# EAGLE design Controller (EAGLE 4.16)

## Sheet 1 of 2
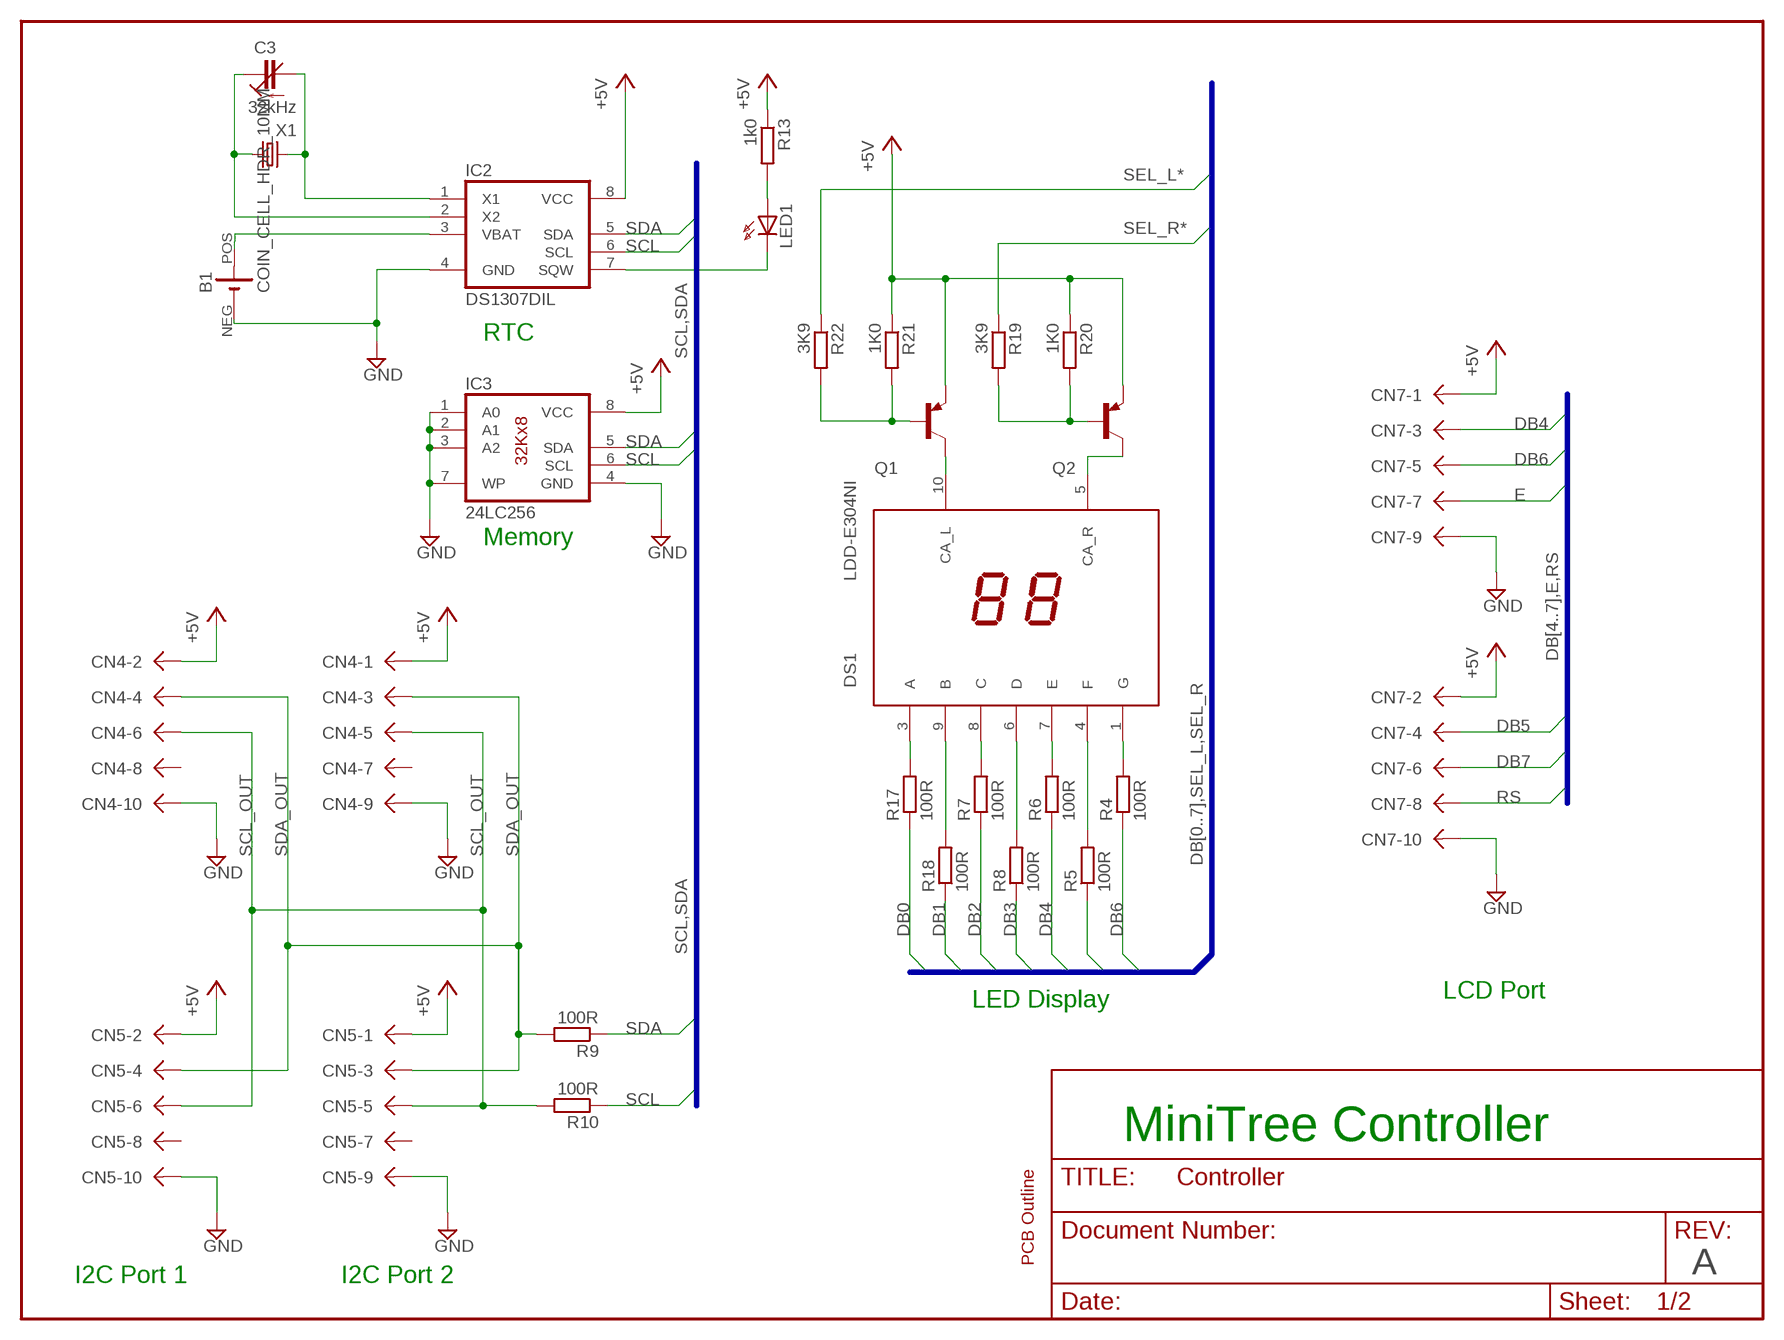
[diagram p0: schematic, sheet 1]

### Parts
B1  COIN_CELL_HDR_10MM  [COIN_10MM_SINGLE_PCB]
C3  GKG20066  [SURFTRIM]
CN4  HDR2X5  [HDR2X5]
CN5  HDR2X5  [HDR2X5]
CN7  HDR2X5  [HDR2X5]
DS1  LDD-E304NI  [DIL10_4]
IC2  DS1307DIL  [DIL08]
IC3  24LC256  [DIL8]
LED1  LEDSMT1206  [1206]
Q1  MMBT4403LT1-PNP-SOT23-BEC  [SOT23-BEC]
Q2  MMBT4403LT1-PNP-SOT23-BEC  [SOT23-BEC]
R4  100R  R-EU_M1206  [M1206]
R5  100R  R-EU_M1206  [M1206]
R6  100R  R-EU_M1206  [M1206]
R7  100R  R-EU_M1206  [M1206]
R8  100R  R-EU_M1206  [M1206]
R9  100R  R-EU_M1206  [M1206]
R10  100R  R-EU_M1206  [M1206]
R13  1k0  R-EU_M1206  [M1206]
R17  100R  R-EU_M1206  [M1206]
R18  100R  R-EU_M1206  [M1206]
R19  3K9  R-EU_M1206  [M1206]
R20  1K0  R-EU_M1206  [M1206]
R21  1K0  R-EU_M1206  [M1206]
R22  3K9  R-EU_M1206  [M1206]
U$1  3.5X6_VREG  [3.5X6_VREG]
X1  32kHz  CRYTALTC26H  [TC26H]

### Nets
+5V: CN4.1 CN4.2 CN5.1 CN5.2 CN7.1 CN7.2 IC2.8(VCC) IC3.8(VCC) Q1.E Q2.E R13.1 R20.1 R21.1 ; also sheet 2
DB0: R17.1 ; also sheet 2
DB1: R18.1 ; also sheet 2
DB2: R7.1 ; also sheet 2
DB3: R8.1 ; also sheet 2
DB4: CN7.6 R6.1 ; also sheet 2
DB5: CN7.5 R5.1 ; also sheet 2
DB6: CN7.4 R4.1 ; also sheet 2
DB7: CN7.3 ; also sheet 2
E: CN7.7 ; also sheet 2
GND: B1.NEG(-) CN4.9 CN4.10 CN5.9 CN5.10 CN7.9 CN7.10 IC2.4(GND) IC3.1(A0) IC3.2(A1) IC3.3(A2) IC3.4(GND) IC3.7(WP) ; also sheet 2
N$1: B1.POS(+) IC2.3(VBAT)
N$7: C3.2(E) IC2.2(X2) X1.1
N$8: C3.1(A) IC2.1(X1) X1.2
N$9: IC2.7(SQW) LED1.C
N$10: LED1.A R13.2
N$13: DS1.10(CA_L) Q1.C
N$14: DS1.5(CA_R) Q2.C
N$15: Q1.B R21.2 R22.2
N$16: Q2.B R19.2 R20.2
N$17: DS1.3(A) R17.2
N$18: DS1.9(B) R18.2
N$19: DS1.8(C) R7.2
N$20: DS1.6(D) R8.2
N$21: DS1.7(E) R6.2
N$22: DS1.4(F) R5.2
N$23: DS1.1(G) R4.2
RS: CN7.8 ; also sheet 2
SCL: IC2.6(SCL) IC3.6(SCL) R10.1 ; also sheet 2
SCL_OUT: CN4.5 CN4.6 CN5.5 CN5.6 R10.2
SDA: IC2.5(SDA) IC3.5(SDA) R9.1 ; also sheet 2
SDA_OUT: CN4.3 CN4.4 CN5.3 CN5.4 R9.2
SEL_L*: R22.1 ; also sheet 2
SEL_R*: R19.1 ; also sheet 2
Unconnected: CN4.7 CN4.8 CN5.7 CN5.8

### Buses
DB[0..7],SEL_L,SEL_R
SCL,SDA
DB[4..7],E,RS

### Notes on the sheet
- RTC
- Memory
- LCD Port
- LED Display
- MiniTree Controller
- A
- I2C Port 1 | I2C Port 2

## Sheet 2 of 2
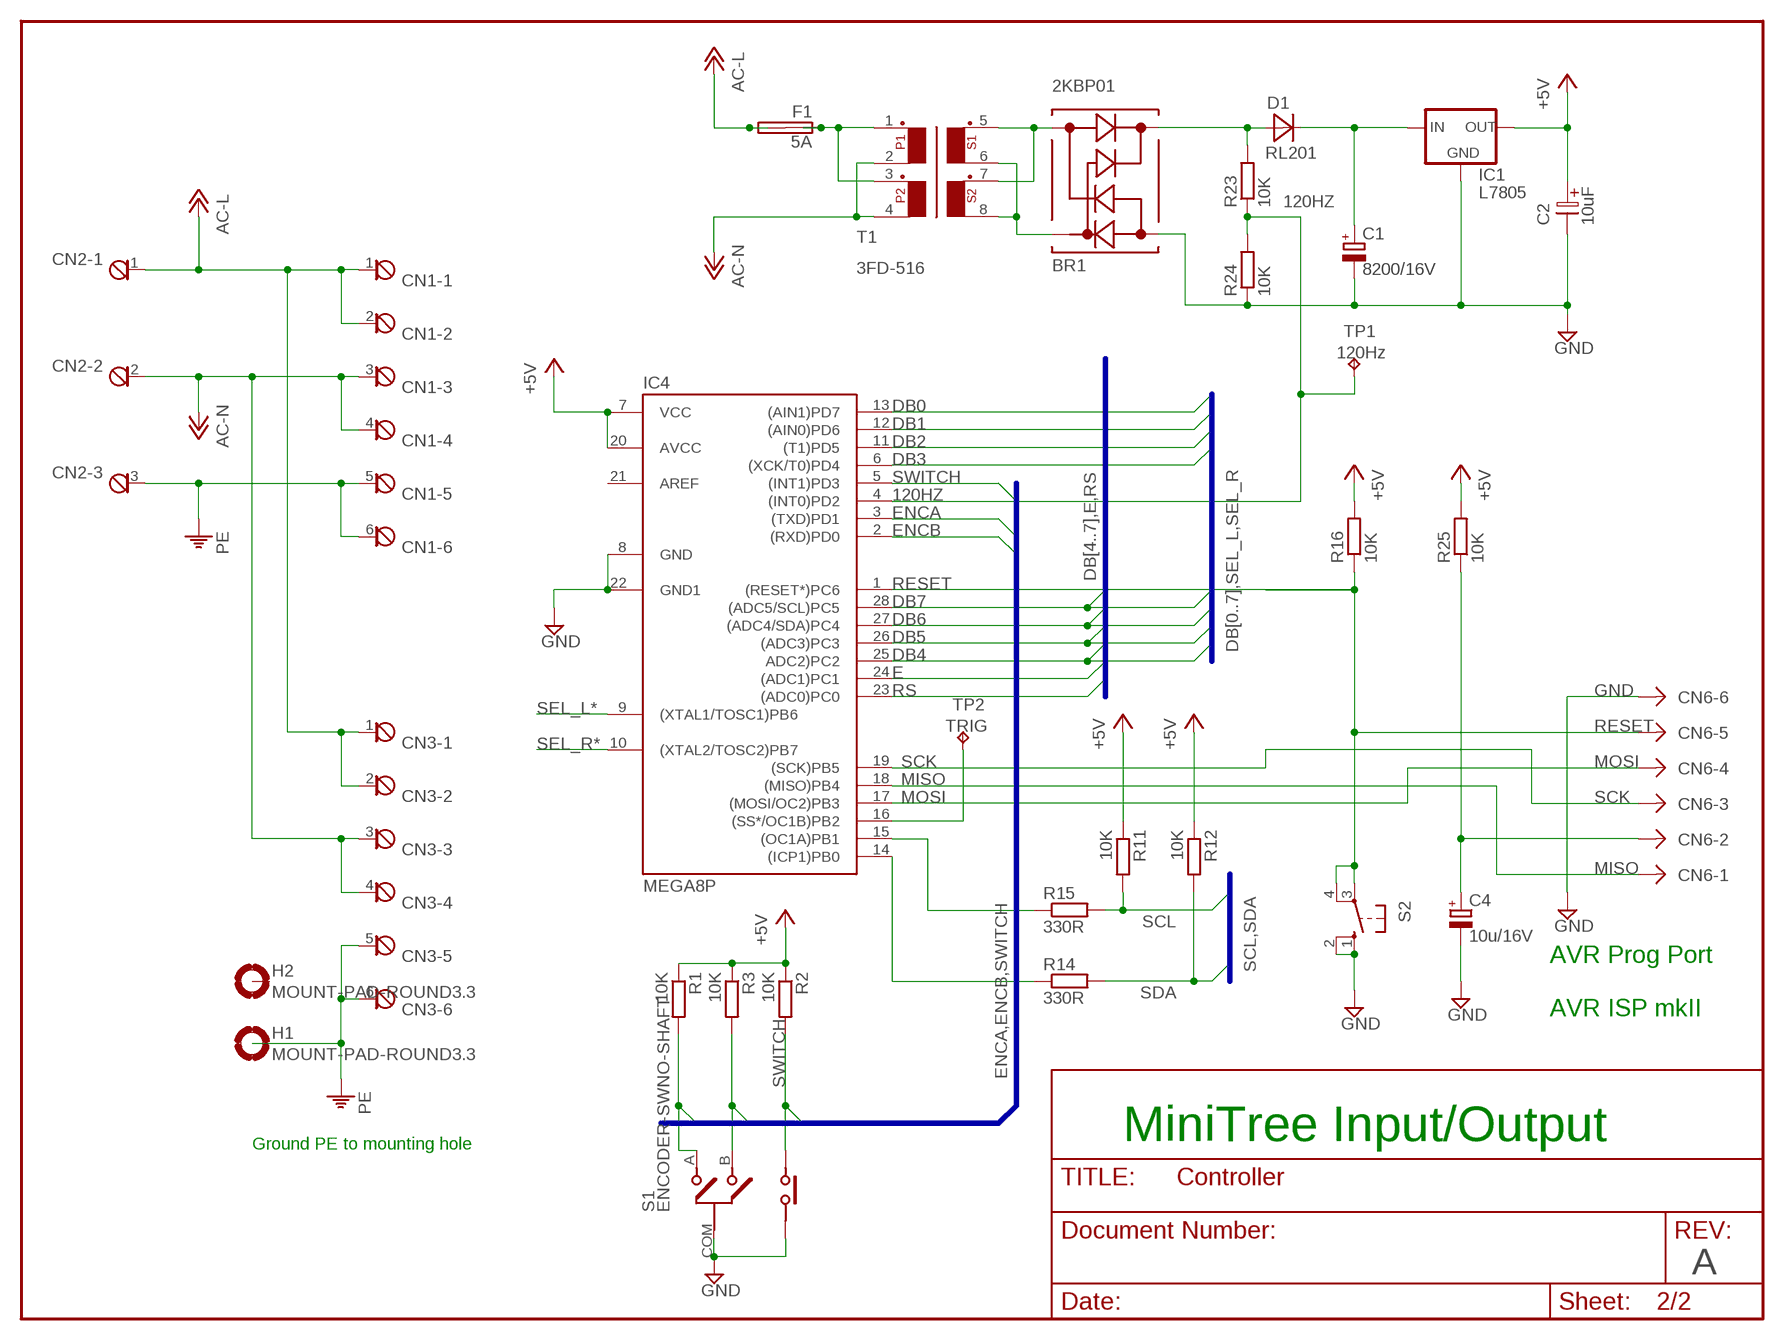
[diagram p1: schematic, sheet 2]

### Parts
BR1  2KBP01  [KBPM]
C1  8200/16V  CPOL-EUE7.5-18  [E7,5-18]
C2  10uF  ELC-2,5L  [ES-2,5L]
C4  10u/16V  CPOL-EUA  [PANASONIC_A]
CN1  OSTTB06  [OSTTB06]
CN2  OSTTB03  [OSTTB03]
CN3  OSTTB06  [OSTTB06]
CN6  HDR2X3  [HDR2X3]
D1  RL201  [DO-15]
F1  5A  SHK20L  [SHK20L]
H1  MOUNT-PAD-ROUND3.3  [3,3-PAD]
H2  MOUNT-PAD-ROUND3.3  [3,3-PAD]
IC1  L7805  L78  [TO220TRI2]
IC4  MEGA8P  [DIL28-3]
R1  10K  R-EU_M1206  [M1206]
R2  10K  R-EU_M1206  [M1206]
R3  10K  R-EU_M1206  [M1206]
R11  10K  R-EU_M1206  [M1206]
R12  10K  R-EU_M1206  [M1206]
R14  330R  R-EU_M1206  [M1206]
R15  330R  R-EU_M1206  [M1206]
R16  10K  R-EU_M1206  [M1206]
R23  10K  R-EU_M1206  [M1206]
R24  10K  R-EU_M1206  [M1206]
R25  10K  R-EU_M1206  [M1206]
S1  ENCODER-SWNO-SHAFT  [X288_NO_SHAFT]
S2  10-XX  [B3F-10XX]
T1  3FD-516  [3FD-5XX]
TP1  120Hz  KEYSTONE_MINIATURE  [KEYSTONE_MINIATURE]
TP2  TRIG  KEYSTONE_MINIATURE  [KEYSTONE_MINIATURE]

### Nets
120HZ: IC4.4((INT0)PD2) R23.1 R24.2 TP1.P$1(TP)
+5V: C2.1 IC1.OUT IC4.7(VCC) IC4.20(AVCC) R1.1 R2.1 R3.1 R11.1 R12.1 R16.2 R25.2 ; also sheet 1
AC-L: CN1.1 CN1.2 CN2.1 CN3.1 CN3.2 F1.2A F1.2B
AC-N: CN1.3 CN1.4 CN2.2 CN3.3 CN3.4 T1.2 T1.4
DB0: IC4.13((AIN1)PD7) ; also sheet 1
DB1: IC4.12((AIN0)PD6) ; also sheet 1
DB2: IC4.11((T1)PD5) ; also sheet 1
DB3: IC4.6((XCK/T0)PD4) ; also sheet 1
DB4: IC4.25(ADC2)PC2) ; also sheet 1
DB5: IC4.26((ADC3)PC3) ; also sheet 1
DB6: IC4.27((ADC4/SDA)PC4) ; also sheet 1
DB7: IC4.28((ADC5/SCL)PC5) ; also sheet 1
E: IC4.24((ADC1)PC1) ; also sheet 1
ENCA: IC4.3((TXD)PD1) R1.2 S1.A
ENCB: IC4.2((RXD)PD0) R3.2 S1.B
GND: BR1.-VE C1.- C2.2 C4.- CN6.6 IC1.GND IC4.8(GND) IC4.22(GND1) R24.1 S1.COM S1.S2 S2.1(S) S2.2(S1) ; also sheet 1
MISO: CN6.1 IC4.18((MISO)PB4)
MOSI: CN6.4 IC4.17((MOSI/OC2)PB3)
N$2: F1.1A F1.1B T1.1 T1.3
N$3: BR1.+VE D1.A R23.2
N$4: BR1.AC1 T1.5 T1.7
N$5: C1.+ D1.C IC1.IN
N$6: BR1.AC2 T1.6 T1.8
N$11: IC4.15((OC1A)PB1) R15.1
N$12: IC4.14((ICP1)PB0) R14.1
N$24: IC4.16((SS*/OC1B)PB2) TP2.P$1(TP)
N$54: C4.+ CN6.2 R25.1
PE: CN1.5 CN1.6 CN2.3 CN3.5 CN3.6 H1.B3,3(MOUNT)
RESET: CN6.5 IC4.1((RESET*)PC6) R16.1 S2.3(P) S2.4(P1)
RS: IC4.23((ADC0)PC0) ; also sheet 1
SCK: CN6.3 IC4.19((SCK)PB5)
SCL: R11.2 R15.2 ; also sheet 1
SDA: R12.2 R14.2 ; also sheet 1
SEL_L*: IC4.9((XTAL1/TOSC1)PB6) ; also sheet 1
SEL_R*: IC4.10((XTAL2/TOSC2)PB7) ; also sheet 1
SWITCH: IC4.5((INT1)PD3) R2.2 S1.S1
Unconnected: H2.B3,3(MOUNT)

### Buses
DB[4..7],E,RS
SCL,SDA
DB[0..7],SEL_L,SEL_R
ENCA,ENCB,SWITCH

### Notes on the sheet
- AVR Prog Port
- AVR ISP mkII
- MiniTree Input/Output
- Ground PE to mounting hole
- A

## Power pins joined to a net without a drawn wire
AREF: IC4.21(AREF)

## Library data of the parts
B1 = battery:COIN_CELL_HDR_10MM
BR1 = rectifier:2KBP*
C1 C4 = rcl:CPOL-EU: POLARIZED CAPACITOR, European symbol
C2 = discrete:ELC-2,5L
C3 = Cap_variable_SMT:GKG20066: Sparague Goodman Surftrim 4.5/20pF
CN1 CN3 = con-OSTTBXX:OSTTB06
CN2 = con-OSTTBXX:OSTTB03
CN4 CN5 CN7 = con-amp-modu-header:HDR2X5
CN6 = con-amp-modu-header:HDR2X3
D1 = diode:RL20*
DS1 = display-LED:LDD-E304NI
F1 = fuse:SHK20L: FUSE HOLDER 5 x 20 mm, SH contact, SHH1 Schukat, E1073 Buerklin
H1 H2 = holes:MOUNT-PAD-ROUND: MOUNTING PAD, round
IC1 = v-reg:L78*
IC2 = maxim:DS1307
IC3 = microchip:24LC256
IC4 = atmel:MEGA8P: Atmel AVR Mega8 Peter J. Stonard 20-Oct-04
LED1 = led:LED: LED
Q1 Q2 = transistor:*-PNP-: PNP Transistror
R1-R25 = rcl:R-EU_: RESISTOR, European symbol
S1 = pot:ENCODER-SW*
S2 = switch-omron:10-XX: OMRON SWITCH
T1 = trafo:3FD-5*
TP1 TP2 = testpad:KEYSTONE_MINIATURE
U$1 = PCB_Outlines:3.5X6_VREG
X1 = crystal:CRYTAL: CRYSTAL

## Board
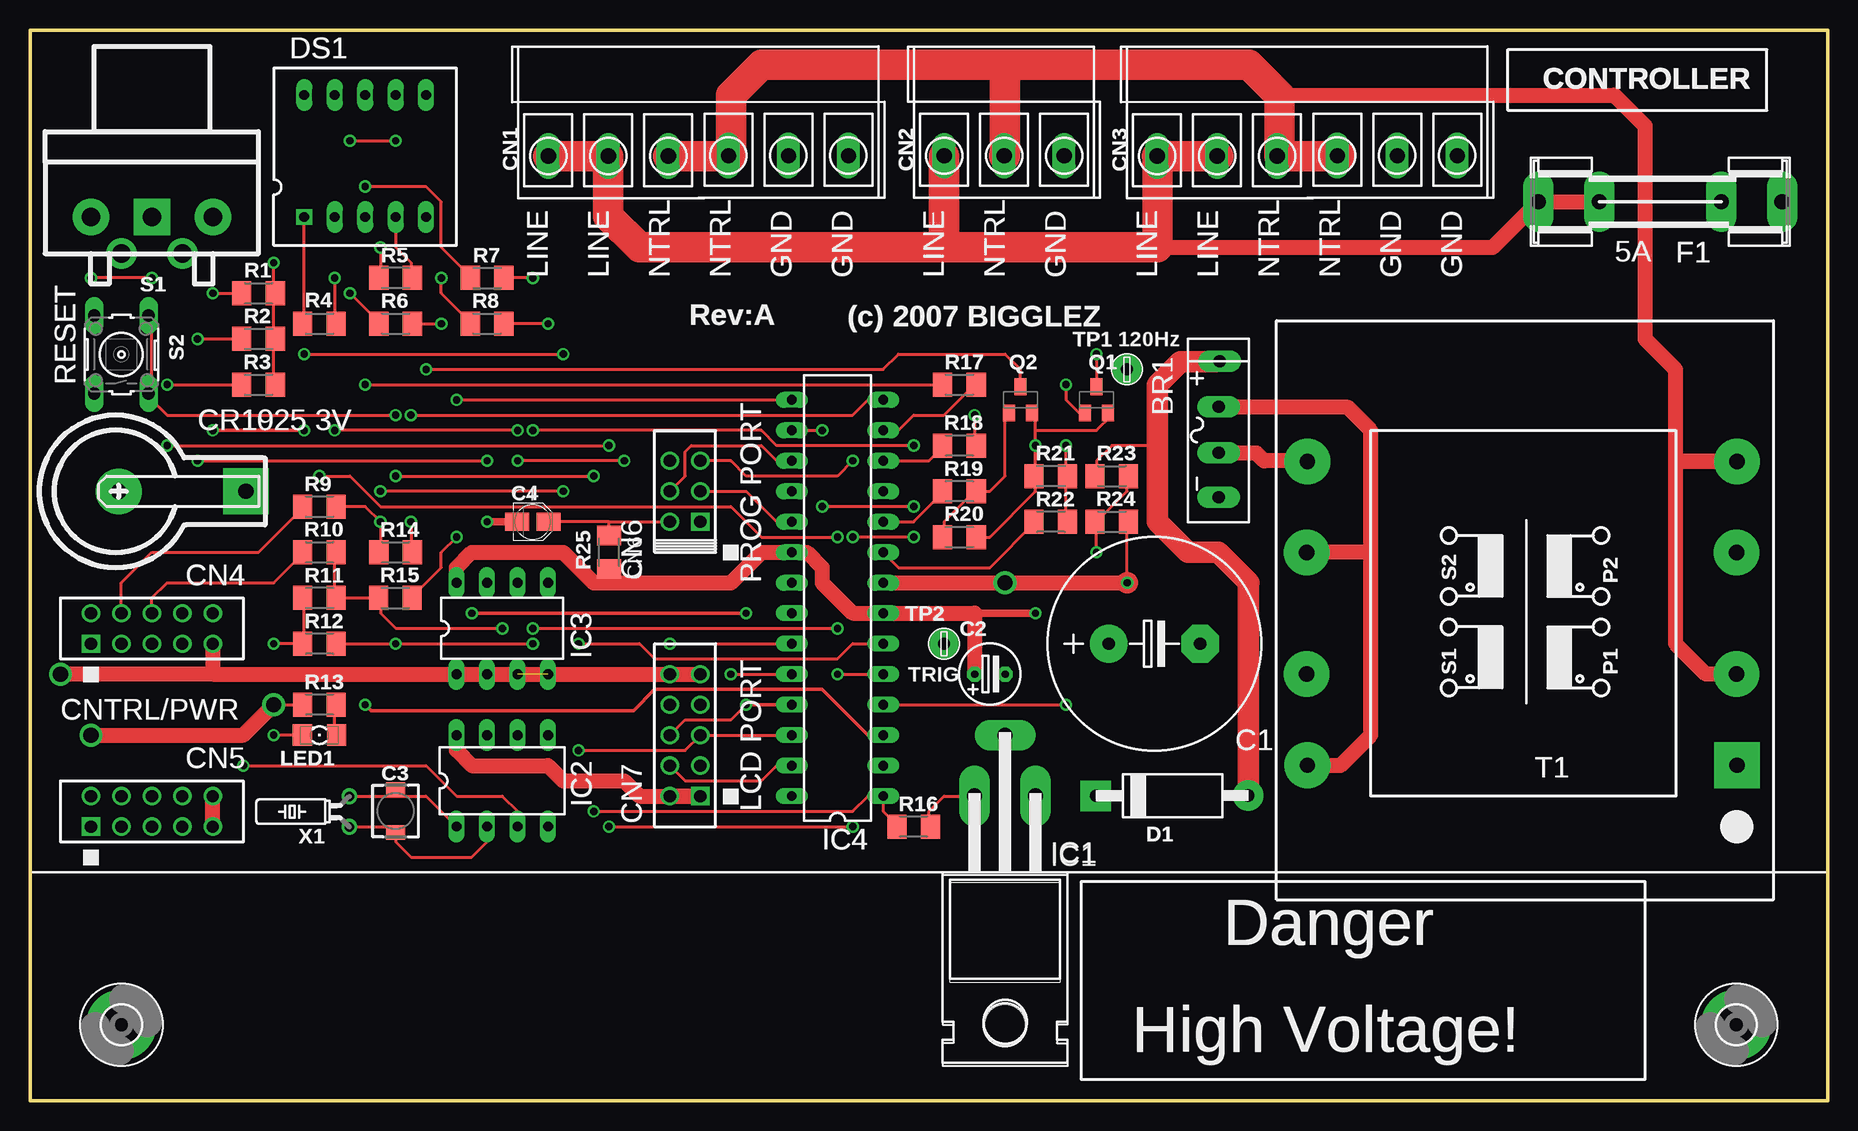
[diagram p2: board, top side]
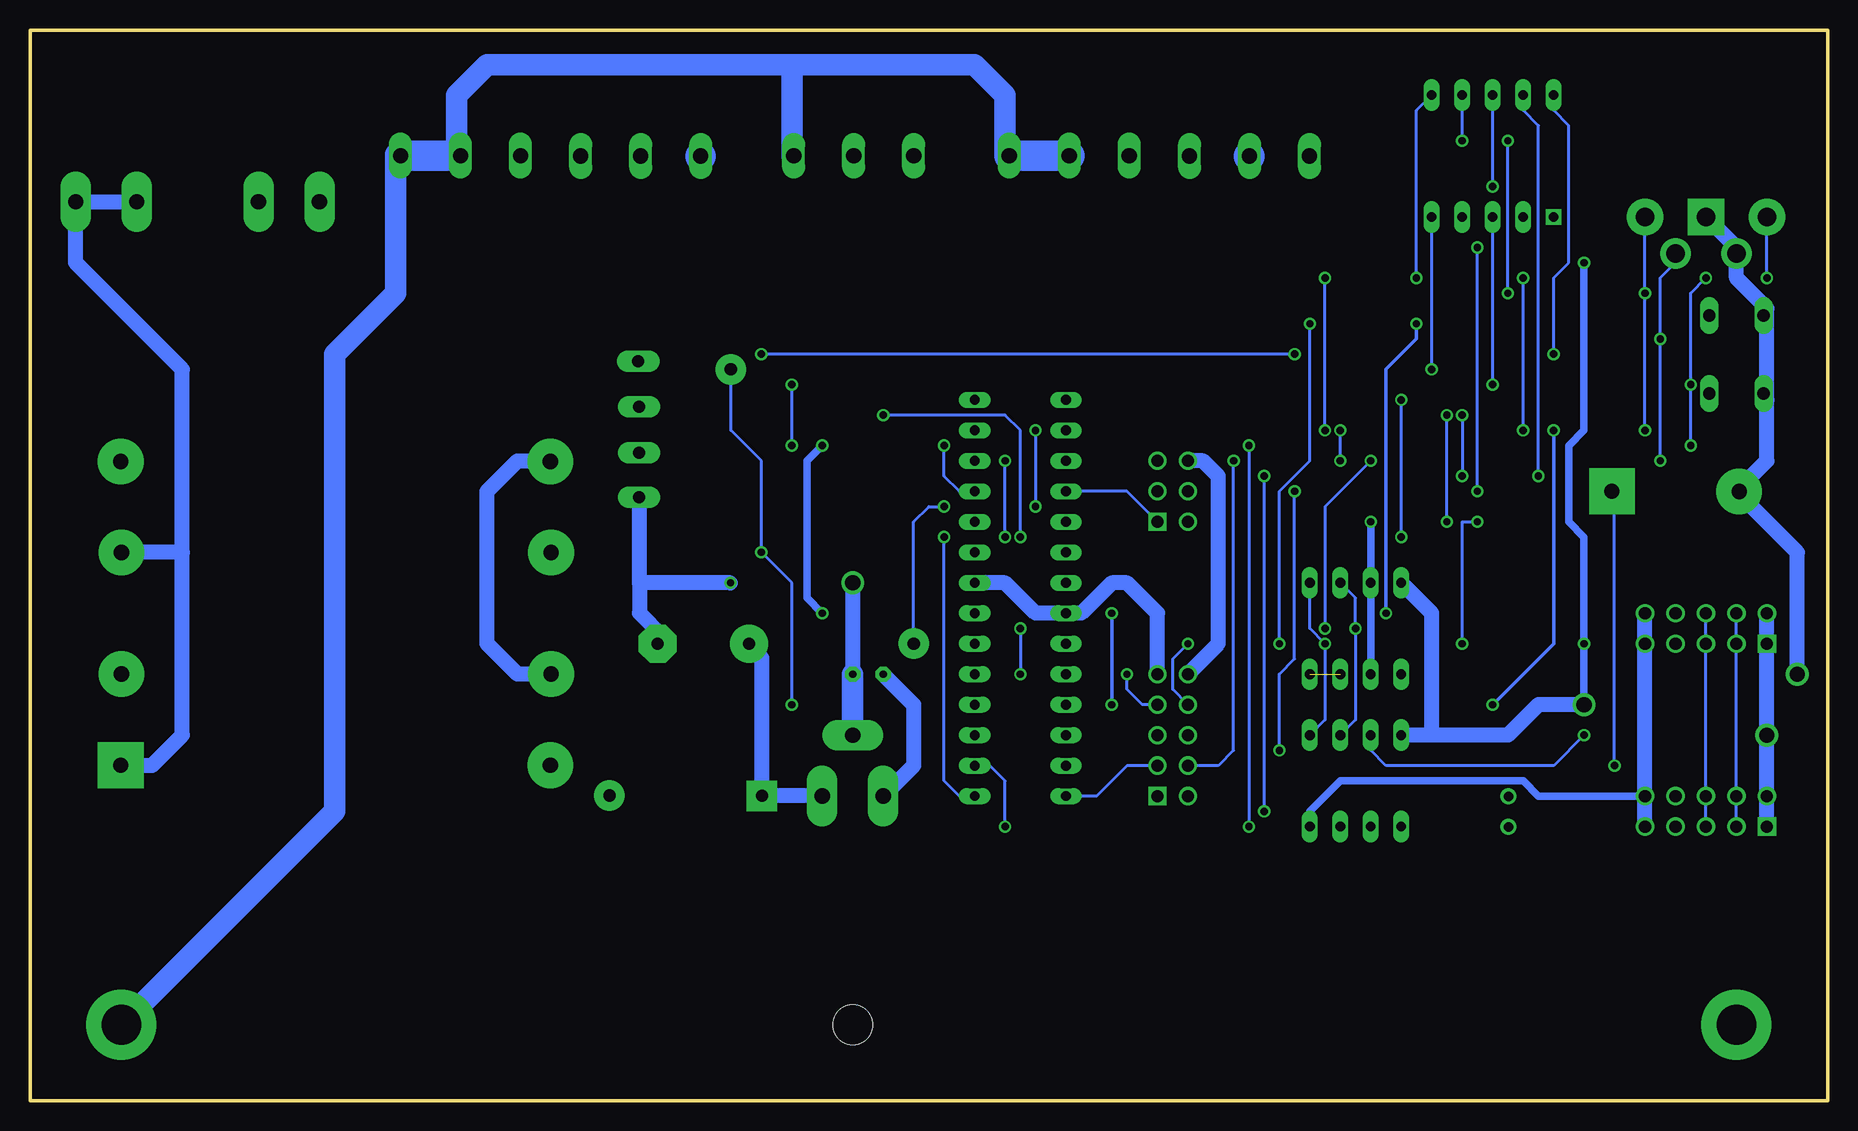
[diagram p3: board, bottom side, seen from below]

Size 149.86 x 89.24 mm. Coordinates in mm from the lower left corner, seen from the top.
Copper layers (1*16): Top 0.035mm / dielectric 1.5mm / Bottom 0.035mm
Design rules "default": minimum track width 10mil, minimum drill 24mil, track to track 8mil, track to pad 8mil, pad to pad 8mil, via to via 8mil, smd to smd 8mil, copper to edge 40mil, drill to drill 8mil, minimum pad ring 10mil, minimum via ring 8mil, stop-mask expansion 4mil, vias tented up to drill 0mil, thermal gap 10mil

### Footprints (pad centres in the part's own frame; a part is rotated, then mirrored left to right if it is on the bottom)
COIN_10MM_SINGLE_PCB = drill 1.27 pad 3.81 round: NEG -5.334,-0.013 | drill 1.27 pad 3.81 square: POS 5.271,0
KBPM = drill 1.016 pad 1.778 long: +VE -5.74,0.102; -VE 5.588,0.025; AC1 -1.93,0.025; AC2 1.88,0.025
E7,5-18 = drill 1.016 pad 3.15 round: + -3.81,0 | drill 1.016 pad 3.15 octagon: - 3.81,0
ES-2,5L = drill 0.61 pad 1.27 octagon: 1 0,0; 2 2.54,0
SURFTRIM = smd 1.6 x 1.2: 1 0,1.8; 2 0,-1.8
PANASONIC_A = smd 2 x 1.5: + 1.3,0; - -1.3,0
OSTTB06 = drill 1.27 long: 1 0,0; 2 5,0; 3 10,0; 4 15.02,0.03; 5 20.02,0.03; 6 25.02,0.03
OSTTB03 = drill 1.27 long: 1 0,0; 2 5,0; 3 10,0
HDR2X5 = drill 1.016 square: 1 0,0 | drill 1.016 round: 2 0,2.54; 3 2.54,0; 4 2.54,2.54; 5 5.08,0; 6 5.08,2.54; 7 7.62,0; 8 7.62,2.54; 9 10.16,0; 10 10.16,2.54
HDR2X3 = drill 1.016 square: 1 0,0 | drill 1.016 round: 2 0,2.54; 3 2.54,0; 4 2.54,2.54; 5 5.08,0; 6 5.08,2.54
DO-15 = drill 1.016 pad 2.54 round: A 12.675,0.025 | drill 1.016 pad 2.54 square: C -0.025,0
DIL10_4 = drill 0.813 square: 1 0,0 | drill 0.813 long: 2 2.54,0; 3 5.08,0; 4 7.62,0; 5 10.16,0; 6 10.16,10.16; 7 7.62,10.16; 8 5.08,10.16; 9 2.54,10.16; 10 0,10.16
SHK20L = drill 1.27 pad 2.54 long: 1A -10.16,0; 1B -5.08,0; 2A 10.16,0; 2B 5.08,0
3,3-PAD = drill 3.3 pad 5.842 round: B3,3 0,0
TO220TRI2 = drill 1.27 pad 2.54 long: GND 0,-12.7; IN -2.54,-7.62; OUT 2.54,-7.62
DIL08 = drill 0.813 long: 1 -3.81,-3.81; 2 -1.27,-3.81; 3 1.27,-3.81; 4 3.81,-3.81; 5 3.81,3.81; 6 1.27,3.81; 7 -1.27,3.81; 8 -3.81,3.81
DIL8 = drill 0.813 long: 1 -3.81,-3.81; 2 -1.27,-3.81; 3 1.27,-3.81; 4 3.81,-3.81; 5 3.81,3.81; 6 1.27,3.81; 7 -1.27,3.81; 8 -3.81,3.81
DIL28-3 = drill 0.813 long: 1 -16.51,-3.81; 2 -13.97,-3.81; 3 -11.43,-3.81; 4 -8.89,-3.81; 5 -6.35,-3.81; 6 -3.81,-3.81; 7 -1.27,-3.81; 8 1.27,-3.81; 9 3.81,-3.81; 10 6.35,-3.81; 11 8.89,-3.81; 12 11.43,-3.81; 13 13.97,-3.81; 14 16.51,-3.81; 15 16.51,3.81; 16 13.97,3.81; 17 11.43,3.81; 18 8.89,3.81; 19 6.35,3.81; 20 3.81,3.81; 21 1.27,3.81; 22 -1.27,3.81; 23 -3.81,3.81; 24 -6.35,3.81; 25 -8.89,3.81; 26 -11.43,3.81; 27 -13.97,3.81; 28 -16.51,3.81
1206 = smd 1.6 x 1.803: A -1.422,0; C 1.422,0
SOT23-BEC = smd 1 x 1.4: B -0.95,-1.1; C 0,1.1; E 0.95,-1.1
M1206 = smd 1.6 x 2: 1 -1.4,0; 2 1.4,0
X288_NO_SHAFT = drill 1.524 pad 3.048 round: A 5.08,0; B -5.08,0 | drill 1.524 pad 3.048 square: COM 0,0 | drill 1.524 pad 2.54 round: S1 2.54,-3.048; S2 -2.54,-3.048
B3F-10XX = drill 1.016 long: 1 -3.251,2.261; 2 3.251,2.261; 3 -3.251,-2.261; 4 3.251,-2.261
3FD-5XX = drill 1.27 pad 3.81 square: 1 -0.025,-0.025 | drill 1.27 pad 3.81 round: 2 0.025,-7.645; 3 0.025,-17.755; 4 -0.025,-25.349; 5 35.789,-0.025; 6 35.839,-7.645; 7 35.839,-17.755; 8 35.789,-25.349
KEYSTONE_MINIATURE = drill 1.016 pad 2.54 round: P$1 0,0
3.5X6_VREG = hole 3.302: 81.28,6.35
TC26H = drill 0.813 round: 1 -1.27,0; 2 1.27,0

### Placement (x,y rotation side)
B1  12.73,50.8 0 top
BR1  99.06,55.91 270 top
C1  93.73,38.1 0 top
C2  78.74,35.56 0 top
C3  30.48,24.16 0 top
C4  41.91,48.26 0 top
CN1  43.21,78.74 0 top
CN2  76.2,78.77 0 top
CN3  93.95,78.74 0 top
CN4  5.08,38.1 0 top
CN5  5.08,22.86 0 top
CN6  55.88,48.26 90 top
CN7  55.88,25.4 90 top
D1  88.87,25.43 0 top
DS1  22.86,73.66 0 top
F1  135.89,74.93 180 top
H1  142.24,6.35 0 top
H2  7.62,6.35 0 top
IC1  81.28,17.78 180 top
IC2  39.37,26.67 0 top
IC3  39.37,39.37 0 top
IC4  67.31,41.91 90 top
LED1  24.13,30.48 180 top
Q1  88.9,58.42 0 top
Q2  82.55,58.42 0 top
R1  19.05,67.31 180 top
R2  19.05,63.5 180 top
R3  19.05,59.69 180 top
R4  24.13,64.77 180 top
R5  30.48,68.58 0 top
R6  30.48,64.77 180 top
R7  38.1,68.58 180 top
R8  38.1,64.77 180 top
R9  24.13,49.53 180 top
R10  24.13,45.72 180 top
R11  24.13,41.91 0 top
R12  24.13,38.1 0 top
R13  24.13,33.02 0 top
R14  30.48,45.72 180 top
R15  30.45,41.91 180 top
R16  73.66,22.86 0 top
R17  77.47,59.69 180 top
R18  77.47,54.61 0 top
R19  77.47,50.8 0 top
R20  77.47,46.99 180 top
R21  85.09,52.07 0 top
R22  85.09,48.26 0 top
R23  90.17,52.07 180 top
R24  90.17,48.26 180 top
R25  48.26,45.72 270 top
S1  10.16,73.66 0 top
S2  7.62,62.2 90 top
T1  142.27,27.94 180 top
TP1  91.44,60.96 0 top
TP2  76.2,38.1 0 top
U$1  0,0 0 top
X1  26.62,24.1 90 top

### Tracks (layer width: path | path; a pad name or v marks a point on that pad's centre or on a via)
120HZ  (via drill 0.61)
  Top 0.254: IC4.4 v86.36,33.02 | v88.9,45.72 88.9,48.26 | 88.9,48.26 R24.2 | 88.9,48.26 91.44,50.8 91.44,52.07 R23.1
  Bottom 0.254: v86.36,33.02 86.36,43.18 v88.9,45.72 88.9,53.34 91.44,55.88 TP1.P$1
+5V  (via drill 0.61, 1.27)
  Top 0.254: 20.32,63.5 20.32,59.69 R3.1 | 20.32,67.31 v20.32,69.85 | 83.82,55.88 88.9,55.88 90.17,57.15 90,57.32 Q1.E | R20.1 80.01,46.99 83.82,50.8 83.82,52.07 | Q2.E 83.65,57.32 83.82,57.15 83.82,55.88 | 83.82,55.88 v83.82,54.61 83.82,52.07 | R13.1 22.73,33.05 22.86,33.05 22.86,33.02 R13.1 v20.32,33.02 | v20.32,38.1 R12.1 22.86,38.1 22.86,41.91 R11.1 | 83.82,52.07 R21.1 | IC1.OUT 76.2,25.4 74.93,24.13 74.93,22.86 R16.2 | 20.32,67.31 R1.1 | 20.32,63.5 20.32,67.31 | 48.26,43.18 R25.2 | 20.32,63.5 R2.1
  Top 0.61: 78.74,40.64 v83.82,40.64
  Top 1.27: v5.08,30.48 17.78,30.48 v20.32,33.02 | C2.1 78.74,40.64 IC4.7 68.58,40.64 66.04,43.18 66.04,44.45 64.77,45.72 IC4.20 60.96,45.72 58.42,43.18 48.26,43.18 46.99,43.18 44.45,45.72 36.83,45.72 35.56,44.45 IC3.8 | CN7.2 CN7.1 50.8,25.4 49.53,26.67 44.45,26.67 43.18,27.94 36.83,27.94 35.56,29.21 IC2.8
  Bottom 0.61: v83.82,54.61 85.09,53.34 85.09,41.91 v83.82,40.64 | v20.32,69.85 20.32,55.88 21.59,54.61 21.59,48.26 20.32,46.99 v20.32,38.1 v20.32,33.02
  Bottom 1.27: CN5.2 v5.08,30.48 | v5.08,30.48 CN4.1 | CN4.1 CN4.2 | CN5.1 CN5.2 | CN5.2 v5.08,30.48 | v5.08,30.48 CN4.1 | v5.08,30.48 CN4.1 | 33.02,30.48 26.67,30.48 24.13,33.02 v20.32,33.02 | IC3.8 33.02,40.64 33.02,30.48 | 78.49,25.65 76.2,27.94 76.2,33.02 C2.1 | 33.02,30.48 IC2.8
  Bottom 1.778: 78.49,25.65 IC1.OUT
AC-L
  Top 1.27: 93.98,71.12 121.92,71.12 F1.2A F1.2B
  Top 2.54: CN1.1 CN1.2 48.2,73.72 50.8,71.12 76.2,71.12 | 76.2,71.12 CN2.1 | 76.2,71.12 93.98,71.12 93.98,78.74 | 99.06,78.74 CN3.2 93.98,78.74 | 93.98,78.74 CN3.1
  Bottom 2.54: CN1.2 48.26,78.74 | CN3.1 93.98,78.74
AC-N
  Top 0.254: CN3.4 | 109.19,78.77 CN3.4 | CN3.4 | 104.14,78.74 CN3.3
  Top 1.27: T1.2 139.72,35.59 139.7,35.56 137.16,38.1 137.16,53.34 | 137.16,53.34 142.24,53.34 T1.4 137.21,53.29 137.16,53.34 | 137.16,53.34 137.16,60.96 134.62,63.5 134.62,81.28 132.08,83.82 104.14,83.82
  Top 2.54: 58.42,78.74 58.39,78.77 CN1.4 | CN1.3 58.42,78.74 | 58.42,78.74 58.42,83.82 60.96,86.36 81.28,86.36 | CN2.2 81.25,78.77 81.28,78.74 81.28,86.36 | 81.28,86.36 101.6,86.36 104.14,83.82 104.14,78.74 109.22,78.74 109.19,78.77
DB0
  Top 0.254: IC4.13 72.39,55.88 73.66,57.15 76.2,57.15 78.74,59.69 R17.1
DB1
  Top 0.254: IC4.12 74.93,53.34 76.2,54.61 R18.1
DB2  (via drill 0.61)
  Top 0.254: 39.37,68.58 R7.1 v41.91,68.58 | v73.66,54.61 62.23,54.61 60.96,55.88 v41.91,55.88
  Bottom 0.254: v41.91,55.88 v41.91,68.58 | IC4.11 72.39,50.8 73.66,52.07 v73.66,54.61
DB3  (via drill 0.61)
  Top 0.254: IC4.6 68.58,38.1 67.31,36.83 52.07,36.83 50.8,38.1 v45.72,38.1 | 39.37,64.77 R8.1 v43.18,64.77
  Bottom 0.254: v45.72,38.1 45.72,50.8 43.18,53.34 v43.18,64.77
DB4  (via drill 0.61)
  Top 0.254: IC4.25 v59.69,33.02 58.42,31.75 54.61,31.75 CN7.6 | v34.29,64.77 R6.1 31.75,64.77
  Top 0.305: v59.69,33.02 IC4.25 | v36.83,40.64 v59.69,40.64
  Bottom 0.305: v59.69,40.64 v59.69,33.02 | v36.83,40.64 36.83,60.96 34.29,63.5 v34.29,64.77
DB5  (via drill 0.61)
  Top 0.254: IC4.26 CN7.5 54.61,29.21 v45.72,29.21 | v44.45,50.8 v29.21,50.8 | R5.1 29.21,68.58 v29.21,71.12
  Bottom 0.254: v29.21,50.8 v29.21,71.12 | v45.72,29.21 45.72,35.56 44.45,36.83 v44.45,50.8
DB6  (via drill 0.61)
  Top 0.254: v49.53,53.34 v40.64,53.34 | v40.64,55.88 v25.4,55.88 | IC4.27 62.23,27.94 60.96,26.67 54.61,26.67 CN7.4 | R4.1 25.4,64.77 v25.4,68.58
  Bottom 0.254: v49.53,53.34 49.53,29.21 50.8,27.94 CN7.4 | v40.64,53.34 v40.64,55.88 | v25.4,55.88 v25.4,68.58
DB7
  Bottom 0.254: IC4.28 60.96,25.4 58.42,27.94 CN7.3
E  (via drill 0.61)
  Top 0.254: v58.42,35.56 IC4.24
  Bottom 0.254: CN7.7 57.15,33.02 58.42,34.29 v58.42,35.56
ENCA  (via drill 0.61)
  Top 0.254: v15.24,67.31 R1.2
  Top 0.305: IC4.3 69.85,30.48 66.04,34.29 52.07,34.29 50.29,32.51 28.45,32.51 v27.94,33.02 | v22.86,55.88 v15.24,55.88
  Bottom 0.254: v15.24,55.88 v15.24,67.31 S1.A
  Bottom 0.305: v27.94,33.02 22.86,38.1 v22.86,55.88
ENCB  (via drill 0.61)
  Top 0.254: v11.43,54.61 v48.26,54.61 | v48.26,22.86 v68.58,22.86 | v10.16,68.58 v5.08,68.58 | v11.43,59.69 R3.2
  Bottom 0.254: v48.26,54.61 v48.26,22.86 | v68.58,22.86 68.58,26.67 69.85,27.94 IC4.2 | v11.43,54.61 v11.43,59.69 11.43,67.31 v10.16,68.58 | v5.08,68.58 S1.B
GND  (via drill 0.61, 1.27)  (1 unrouted)
  Top 0.254: R24.1 91.44,48.26 91.44,43.18
  Top 0.61: v38.1,48.26 C4.-
  Top 1.27: CN5.9 CN5.10 | 91.44,43.18 v81.28,43.18 IC4.8 | CN7.9 CN7.10 IC3.4 IC3.2 IC3.1 15.24,35.56 | CN4.9 15.24,35.56 | 15.24,35.56 v2.54,35.56
  Top 1.778: 91.44,43.18 v91.47,43.18
  Bottom 0.254: 7.61,50.79 B1.NEG | 5.08,66.04 5.36,65.76 S2.2 | BR1.-VE 99.06,50.32 99.06,50.55
  Bottom 0.61: IC3.2 IC3.7 v38.1,48.26 | IC2.4 43.18,24.13 40.64,26.67 25.4,26.67 24.13,25.4 CN5.10
  Bottom 1.27: CN4.10 CN4.9 CN5.10 CN5.9 | v91.47,43.18 99.06,43.18 | 99.06,43.18 99.06,50.32 | 5.08,58.42 5.08,66.04 7.62,68.58 S1.S2 7.62,71.12 S1.COM | S2.1 5.36,58.7 5.08,58.42 | 5.08,58.42 5.08,53.34 7.62,50.8 | 7.62,50.8 7.61,50.79 | IC4.8 68.58,43.18 66.04,40.64 IC4.22 62.23,40.64 59.69,43.18 58.42,43.18 55.88,40.64 CN7.9 | 7.62,50.8 2.54,45.72 v2.54,35.56 | v81.28,43.18 C2.2 | 99.06,43.18 99.06,40.64 97.16,38.73 97.16,38.48 C1.- | CN7.10 50.8,38.1 50.8,52.07 52.07,53.34 CN6.6
  Bottom 1.778: C2.2 IC1.GND
MISO
  Bottom 0.254: CN6.1 58.42,50.8 IC4.18
MOSI
  Top 0.254: CN6.4 54.61,52.07 54.61,54.1 55.12,54.61 60.96,54.61 62.23,53.34 IC4.17
N$1  (via drill 0.61)
  Top 0.254: v17.78,27.94 33.02,27.94 35.56,25.4 39.37,25.4 40.64,24.13 IC2.3
  Bottom 0.254: B1.POS 17.78,50.8 v17.78,27.94
N$2
  Bottom 1.27: T1.3 142.24,45.72 137.16,45.72 | 137.16,45.72 137.16,30.48 139.7,27.94 139.72,27.96 142.22,27.96 142.24,27.94 142.26,27.96 T1.1 | 137.16,45.72 137.16,60.96 146.05,69.85 F1.1A F1.1B
N$3
  Top 0.254: 88.77,51.94 R23.2 88.9,52.07 88.9,53.34 90.17,54.61 93.98,54.61 93.98,53.34 | 99.31,61.72 99.31,61.65 | 99.31,61.65 BR1.+VE | 98.81,61.59 99.31,61.59 99.31,61.65
  Top 1.778: D1.A 101.55,43.13 101.6,43.18 99.06,45.72 96.52,45.72 93.98,48.26 93.98,53.34 93.98,59.69 95.89,61.59 98.81,61.59
N$4
  Top 0.254: 99.06,57.91 99.06,57.84 | 99.06,57.84 BR1.AC1 | 99.06,57.78 99.06,57.84
  Top 1.27: T1.5 109.19,27.96 109.22,27.94 111.76,30.48 111.76,45.72 | T1.7 106.66,45.7 106.68,45.72 111.76,45.72 | 99.06,57.78 109.86,57.78 111.76,55.88 111.76,45.72
N$5
  Bottom 1.27: 83.84,25.43 D1.C 88.85,36.91 90.04,38.1 C1.+
  Bottom 1.778: IC1.IN 83.84,25.43
N$6
  Top 1.27: T1.8 106.68,53.29 106.68,53.34 102.87,53.34 102.23,53.98 99.19,53.98 99.08,54.08 | 99.08,54.08 99.06,54.1 | 99.08,54.08 BR1.AC2
  Bottom 1.27: T1.6 106.66,35.59 106.68,35.56 109.22,35.56 111.76,38.1 111.76,50.8 109.22,53.34 106.55,53.34 106.5,53.29 T1.8
N$7
  Top 0.254: 30.48,22.86 C3.2 | IC2.2 38.1,21.59 36.83,20.32 31.75,20.32 30.48,21.59 30.48,22.86 | X1.1 30.45,22.84 30.48,22.86
N$8
  Top 0.254: X1.2 30.45,25.38 30.48,25.4 | 30.48,25.4 C3.1 | IC2.1 33.02,25.4 30.48,25.4
N$9  (via drill 0.61)
  Top 0.254: LED1.C v20.32,30.48
  Bottom 0.254: v20.32,30.48 22.86,27.94 36.83,27.94 38.1,29.21 IC2.7
N$10
  Top 0.254: 25.4,33.02 25.43,33.05 | LED1.A 25.4,30.48 25.4,33.02 | 25.4,33.02 R13.2
N$11  (via drill 0.61)
  Top 0.254: v35.56,46.99 34.29,45.72 34.29,44.45 31.75,41.91 R15.1 | v35.56,58.42 IC4.15
  Bottom 0.254: v35.56,46.99 v35.56,58.42
N$12  (via drill 0.61)
  Top 0.254: IC4.14 69.85,58.42 68.58,57.15 v31.75,57.15 | R14.1 31.75,45.72 v31.75,48.26
  Bottom 0.254: v31.75,48.26 v31.75,57.15
N$13  (via drill 0.61)
  Top 0.254: v22.86,62.23 v44.45,62.23 | v88.9,62.23 Q1.C
  Bottom 0.254: v44.45,62.23 v88.9,62.23 | v22.86,62.23 22.86,68.58 21.59,69.85 21.59,81.28 22.86,82.55 DS1.10
N$14  (via drill 0.61)
  Top 0.254: v33.02,60.96 71.12,60.96 72.39,62.23 81.28,62.23 82.55,60.96 Q2.C 82.55,59.44
  Bottom 0.254: v33.02,60.96 DS1.5
N$15  (via drill 0.61)
  Top 0.254: 86.36,52.07 v86.36,54.61 | v86.36,59.69 86.36,58.42 87.63,57.15 87.8,57.32 Q1.B | R22.2 86.36,48.26 86.36,52.07 | 86.36,52.07 86.49,51.94 R21.2 86.36,52.07
  Bottom 0.254: v86.36,54.61 v86.36,59.69
N$16
  Top 0.254: Q2.B 81.45,57.32 81.28,57.15 81.28,52.07 80.01,50.8 R19.2 78.74,50.8 76.2,48.26 76.2,46.99 R20.2
N$17  (via drill 0.61)
  Top 0.254: v27.94,59.69 R17.2
  Bottom 0.254: v27.94,59.69 DS1.3
N$18  (via drill 0.61)
  Top 0.254: v24.13,52.07 26.67,52.07 29.21,49.53 58.42,49.53 60.96,46.99 v67.31,46.99 | R18.2 78.74,54.61 v78.74,57.15
  Bottom 0.254: DS1.9 25.4,82.55 24.13,81.28 v24.13,52.07 | v67.31,46.99 67.31,55.88 68.58,57.15 v78.74,57.15
N$19  (via drill 0.61)
  Top 0.254: v27.94,76.2 33.02,76.2 34.29,74.93 34.29,71.12 36.83,68.58 R7.2
  Bottom 0.254: v27.94,76.2 DS1.8
N$20  (via drill 0.61)
  Top 0.254: v34.29,68.58 34.29,67.31 36.83,64.77 R8.2
  Bottom 0.254: v34.29,68.58 34.29,82.55 DS1.6
N$21  (via drill 0.61)
  Top 0.254: v26.67,80.01 v30.48,80.01 | v26.67,67.31 29.21,64.77 R6.2
  Bottom 0.254: v26.67,67.31 v26.67,80.01 | v30.48,80.01 DS1.7
N$22
  Top 0.254: DS1.4 30.48,71.12 31.75,69.85 31.75,68.58 R5.2
N$23
  Top 0.254: DS1.1 22.89,73.64 22.86,73.61 22.86,64.77 R4.2
N$24  (via drill 0.61)
  Top 0.254: v73.66,49.53 v66.04,49.53 | IC4.16 v66.04,55.88
  Bottom 0.254: TP2.P$1 76.2,48.26 74.93,49.53 v73.66,49.53 | v66.04,55.88 v66.04,49.53
N$54
  Top 0.254: 48.26,48.26 CN6.2 | 48.26,46.99 R25.1 48.26,48.26 | 43.18,48.26 C4.+ 48.26,48.26
PE
  Bottom 0.254: 118.62,78.74 118.62,78.77 | 118.62,78.77 CN3.6 | 119.38,78.89 118.62,78.89 118.62,78.77
  Bottom 1.778: 114.3,78.77 114.3,78.74 | 114.3,78.77 CN3.5 | 114.3,78.77 114.3,83.82 111.76,86.36 86.36,86.36 | CN2.3 86.33,78.77 86.36,78.74 86.36,86.36 | CN1.6 68.55,78.77 68.58,78.74 68.58,83.82 71.12,86.36 86.36,86.36 | H1.B3,3 124.46,24.13 124.46,62.23 119.38,67.31 119.38,78.89
  Bottom 2.54: 114.3,78.77 CN3.6 | CN1.5 CN1.6
RESET  (via drill 0.61)
  Top 0.254: S2.4 9.86,65.43 10.16,65.13 10.16,58.42 | 10.16,58.42 10.16,58.67 S2.3 | v73.66,46.99 v68.58,46.99 | v68.58,53.34 67.31,52.07 59.69,52.07 58.42,53.34 CN6.5 | v46.99,24.13 68.58,24.13 69.85,25.4 IC4.1 71.12,24.13 72.39,22.86 R16.1 | v30.48,52.07 v46.99,52.07 | v30.48,57.15 11.43,57.15 10.16,58.42
  Bottom 0.254: IC4.1 72.39,25.4 73.66,26.67 v73.66,46.99 | v68.58,46.99 v68.58,53.34 | v46.99,52.07 v46.99,24.13 | v30.48,57.15 v30.48,52.07
RS  (via drill 0.61)
  Top 0.254: v53.34,38.1 IC4.23
  Bottom 0.254: CN7.8 54.61,34.29 54.61,36.83 v53.34,38.1
SCK
  Top 0.254: IC4.19 62.23,48.26 59.69,50.8 CN6.3
SCL  (via drill 0.61)
  Top 0.254: v39.37,39.37 30.48,39.37 29.21,40.64 29.21,41.91 R15.2 R11.2 25.4,41.91 25.4,45.72 R10.1
  Bottom 0.254: IC3.6 39.37,41.91 v39.37,39.37 39.37,31.75 IC2.6
SCL_OUT
  Top 0.254: CN4.6 10.16,41.91 11.43,43.18 20.32,43.18 22.86,45.72 R10.2
  Bottom 0.254: CN4.6 CN4.5 CN5.6 CN5.5
SDA  (via drill 0.61)
  Top 0.254: R12.2 v30.48,38.1 v41.91,38.1 | R14.2 29.21,45.72 v29.21,48.26 27.94,49.53 R9.1
  Bottom 0.254: IC3.5 43.18,39.37 v41.91,38.1 41.91,31.75 IC2.5 | v30.48,38.1 30.48,48.26 v29.21,48.26
SDA_OUT
  Top 0.254: CN4.4 7.62,43.18 10.16,45.72 19.05,45.72 22.86,49.53 R9.2
  Bottom 0.254: CN4.4 CN4.3 CN5.4 CN5.3
SEL_L*
  Top 0.254: IC4.9 72.39,44.45 80.01,44.45 83.82,48.26 R22.1
SEL_R*
  Top 0.254: IC4.10 73.66,48.26 76.2,50.8 R19.1
SWITCH  (via drill 0.61)
  Top 0.254: v13.97,53.34 v38.1,53.34 | v41.91,39.37 v67.31,39.37 | v67.31,35.56 IC4.5 | R2.2 | 17.75,63.52 17.78,63.5 R2.2 | v13.97,63.5 R2.2
  Bottom 0.254: v13.97,53.34 v13.97,63.5 13.97,68.58 12.7,69.85 S1.S1 | v38.1,53.34 41.91,49.53 v41.91,39.37 | v67.31,39.37 v67.31,35.56

### Text on the board
tPlace: CONTROLLER | CONTROLLER | LINE | LINE | NTRL | NTRL | GND | GND | LINE | NTRL | GND | LINE | LINE | NTRL | NTRL | GND | GND | Rev:A | (c) 2007 BIGGLEZ | RESET | CR1025 3V | PROG PORT | CNTRL/PWR | LCD PORT | Danger | High Voltage!
_tsilk: DS1 | DS1 | CONTROLLER | CONTROLLER | CONTROLLER | CONTROLLER | CN1 | CN1 | CN2 | CN2 | CN3 | CN3 | R5 | R5 | R7 | R7 | 5A | 5A | F1 | F1 | R1 | R1 | LINE | LINE | LINE | LINE | NTRL | NTRL | NTRL | NTRL | GND | GND | GND | GND | LINE | LINE | NTRL | NTRL | GND | GND | LINE | LINE | LINE | LINE | NTRL | NTRL | NTRL | NTRL | GND | GND | GND | GND | S1 | S1 | R4 | R4 | R6 | R6 | R8 | R8 | Rev:A | (c) 2007 BIGGLEZ | R2 | R2 | TP1 | 120Hz | S2 | S2 | R3 | R3 | R17 | R17 | Q2 | Q2 | Q1 | Q1 | RESET | RESET | BR1 | BR1 | CR1025 3V | CR1925 3V | R18 | R18 | R21 | R21 | R23 | R23 | R19 | R19 | R9 | R9 | C4 | R22 | R22 | R24 | R24 | R25 | R20 | R20 | R10 | R10 | R14 | R14 | S2 | S2 | P2 | P2 | CN4 | CN4 | R11 | R11 | R15 | R15 | CN6 | CN6 | PROG PORT | PROG PORT | TP2 | R12 | R12 | C2 | C2 | S1 | S1 | P1 | P1 | IC3 | IC3 | TRIG | R13 | R13 | CNTRL/PWR | CNTRL/PWR | LED1 | LED1 | C1 | C1 | T1 | T1 | CN5 | CN5 | C3 | C3 | IC2 | IC2 | LCD PORT | LCD PORT | R16 | R16 | X1 | X1 | CN7 | CN7 | IC4 | IC4 | IC1 | IC1 | D1 | D1 | Danger | Danger | High Voltage! | High Voltage!